# EAGLE design rf-temperature-sensor (EAGLE 9.6.2)
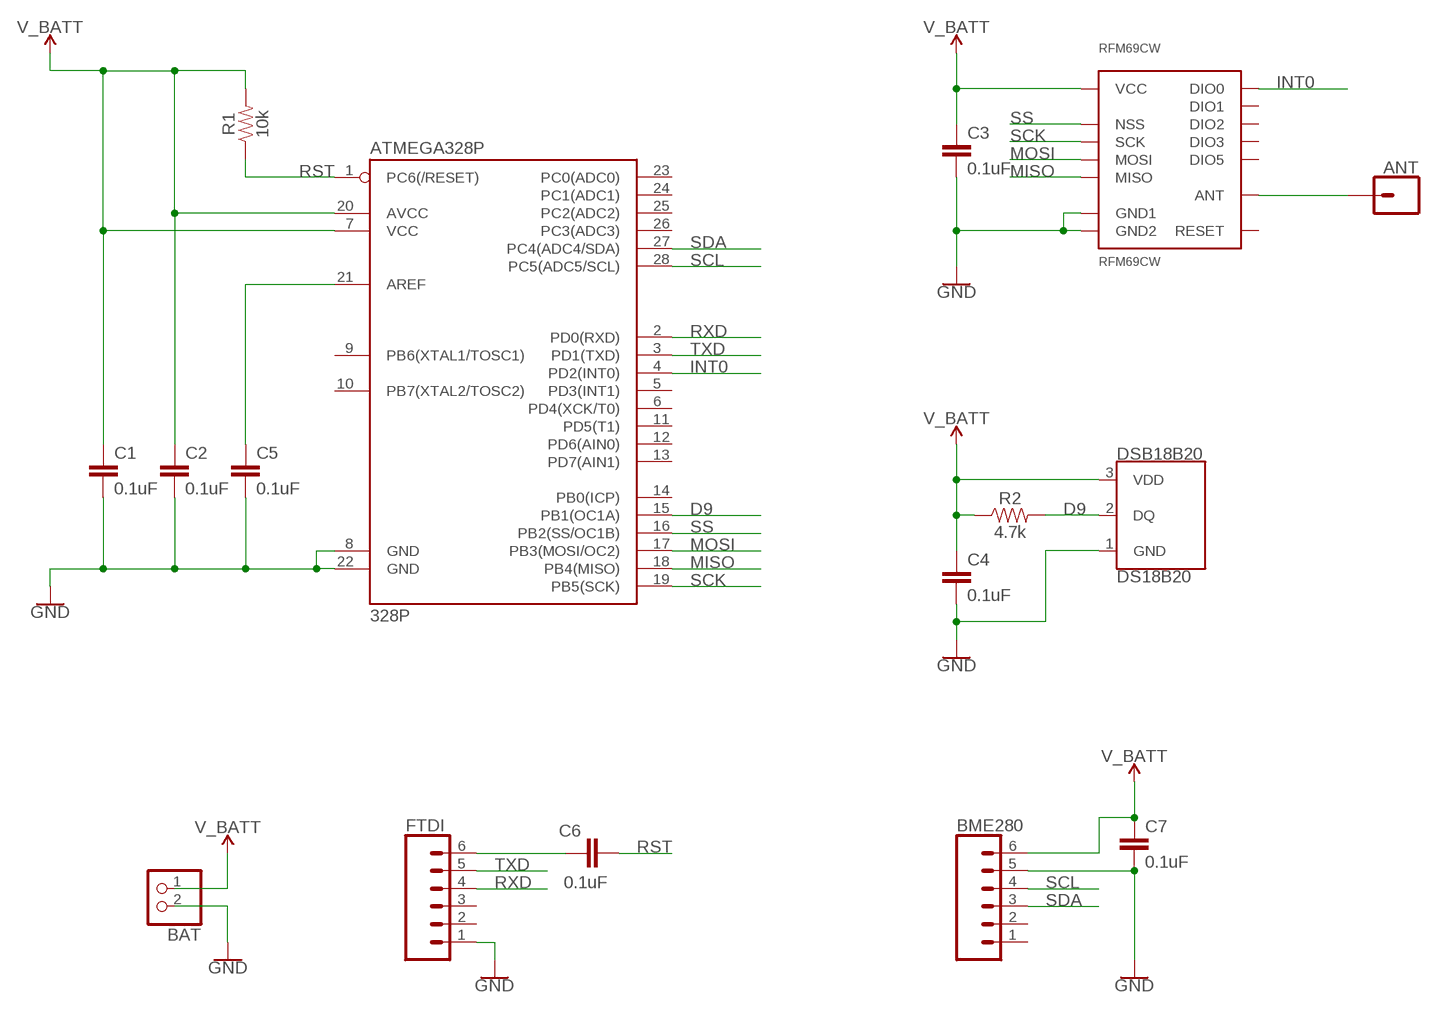
[diagram p0: schematic, sheet 1]

## Parts
ANT  CONN_01  [1X01]
ATMEGA328P  328P  ATMEGA328P_PDIP  [DIP28]
BAT  JST_2PIN-THM-RA  [JST-PH-2-THM-RA]
BME280  CONN_06SILK_FEMALE_PTH  [1X06]
C1  0.1uF  0.1UF-0603-25V-5%  [0603]
C2  0.1uF  0.1UF-0603-25V-5%  [0603]
C3  0.1uF  0.1UF-0603-25V-5%  [0603]
C4  0.1uF  0.1UF-0603-25V-5%  [0603]
C5  0.1uF  0.1UF-0603-25V-5%  [0603]
C6  0.1uF  0.1UF-0603-25V-5%  [0603]
C7  0.1uF  0.1UF-0603-25V-5%  [0603]
DSB18B20  DS18B20  [TO-92-AMMO]
FTDI  CONN_06SILK_FEMALE_PTH  [1X06]
R1  10k  10KOHM-0603-1/10W-1%  [0603]
R2  4.7k  4.7KOHM-0603-1/10W-1%  [0603]
RFM69CW  RFM69CW  [RFM69CW]

## Nets
D9: ATMEGA328P.15(PB1(OC1A)) DSB18B20.2(DQ) R2.2
GND: ATMEGA328P.8(GND) ATMEGA328P.22(GND) BAT.2 BME280.5 C1.2 C2.2 C3.2 C4.2 C5.2 C7.2 DSB18B20.1(GND) FTDI.1 RFM69CW.GND@1(GND1) RFM69CW.GND@2(GND2)
INT0: ATMEGA328P.4(PD2(INT0)) RFM69CW.DIO0
MISO: ATMEGA328P.18(PB4(MISO)) RFM69CW.MISO
MOSI: ATMEGA328P.17(PB3(MOSI/OC2)) RFM69CW.MOSI
N$2: ATMEGA328P.21(AREF) C5.1
N$3: ANT.1 RFM69CW.ANT
N$7: C6.1 FTDI.6
RST: ATMEGA328P.1(PC6(/RESET)) C6.2 R1.1
RXD: ATMEGA328P.2(PD0(RXD)) FTDI.4
SCK: ATMEGA328P.19(PB5(SCK)) RFM69CW.SCK
SCL: ATMEGA328P.28(PC5(ADC5/SCL)) BME280.4
SDA: ATMEGA328P.27(PC4(ADC4/SDA)) BME280.3
SS: ATMEGA328P.16(PB2(SS/OC1B)) RFM69CW.NSS
TXD: ATMEGA328P.3(PD1(TXD)) FTDI.5
V_BATT: ATMEGA328P.7(VCC) ATMEGA328P.20(AVCC) BAT.1 BME280.6 C1.1 C2.1 C3.1 C4.1 C7.1 DSB18B20.3(VDD) R1.2 R2.1 RFM69CW.VDD(VCC)
Unconnected: ATMEGA328P.5(PD3(INT1)) ATMEGA328P.6(PD4(XCK/T0)) ATMEGA328P.9(PB6(XTAL1/TOSC1)) ATMEGA328P.10(PB7(XTAL2/TOSC2)) ATMEGA328P.11(PD5(T1)) ATMEGA328P.12(PD6(AIN0)) ATMEGA328P.13(PD7(AIN1)) ATMEGA328P.14(PB0(ICP)) ATMEGA328P.23(PC0(ADC0)) ATMEGA328P.24(PC1(ADC1)) ATMEGA328P.25(PC2(ADC2)) ATMEGA328P.26(PC3(ADC3)) BME280.1 BME280.2 FTDI.2 FTDI.3 RFM69CW.DIO1 RFM69CW.DIO2 RFM69CW.DIO3 RFM69CW.DIO5 RFM69CW.RESET

## Library data of the parts
ANT = SparkFun-Connectors:CONN_01: Single connection point. Often used as Generic Header-pin footprint for 0.1 inch spaced/style header connections On any of the 0.1 inch spaced packages, you can populate with these: Break Away Headers - Straight <https://www.sparkfun.com/products/116> (PRT-00116) Break Away Male Headers - Right Angle <https://www.sparkfun.com/products/553> (PRT-00553) Female Headers <https://www.sparkfun.com/products/115> (PRT-00115) Break Away Headers - Machine Pin <https://www.sparkfun.com/products/117> (PRT-00117) Break Away Female Headers - Swiss Machine Pin <https://www.sparkfun.com/products/743> (PRT-00743) This device is also useful as a general connection point to wire up your design to another part of your project. Our various solder wires solder well into these plated through hole pads. Hook-Up Wire - Assortment (Stranded, 22 AWG) <https://www.sparkfun.com/products/11375> (PRT-11375) Hook-Up Wire - Assortment (Solid Core, 22 AWG) <https://www.sparkfun.com/products/11367> (PRT-11367) View the entire wire category on our website here <https://www.sparkfun.com/categories/141> Special notes: SMTSO-256-ET is a "flush mount" nut for a 4-40 screw. We mostly use this on specialty testbeds; it is a nice way to connect hardware to your PCB at an adjustable hieght. Also note, the SNAP packages are for using a snappable style connector. We sell a baggie of snaps and they are also used on two LilyPad designs: Snap Assortment - 30 pack (male and female) <https://www.sparkfun.com/products/11347> (DEV-11347) LilyPad Arduino SimpleSnap <https://www.sparkfun.com/products/10941> (DEV-10941) LilyPad SimpleSnap Protoboard <https://www.sparkfun.com/products/10940> (DEV-10940)
ATMEGA328P = SparkFun-IC-Microcontroller:ATMEGA328P_PDIP: Atmel 328P Through hole ATMEGA328P uC used in the Arduino 32kb flash, 1k EEPROM, 2k SRAM Datasheet <http://www.sparkfun.com/datasheets/Components/SMD/ATMega328.pdf> SparkFun Products Storefront component: AVR 28 Pin 20MHz 32K 6A/D - ATMega328P <https://www.sparkfun.com/products/9061> (COM-09061) SparkFun Simon Says - Through-Hole Soldering Kit <https://www.sparkfun.com/products/10547> (KIT-10547) SparkFun Learn to Solder - Simon Says <https://www.sparkfun.com/products/13708> (KIT-13708) SparkFun BigTime Watch Kit <https://www.sparkfun.com/products/11734> (KIT-11734) SparkFun ClockIt <https://www.sparkfun.com/products/10930> (KIT-10930) SparkFun Serial Enabled LCD Kit <https://www.sparkfun.com/products/10097> (LCD-10097) SparkFun Simon Tilts - Through Hole Soldering Kit <https://www.sparkfun.com/products/12634> (KIT-12634) SparkFun Frequency Counter Kit <https://www.sparkfun.com/products/10140> (KIT-10140) FabFM Radio Kit <https://www.sparkfun.com/products/11043> (KIT-11043) SparkFun Binary Blaster Kit <https://www.sparkfun.com/products/12037> (KIT-12037) SparkFun Metro-Gnome <https://www.sparkfun.com/products/9236> (KIT-09236) ATmega328 with Arduino Optiboot (Uno) <https://www.sparkfun.com/products/10524> (DEV-10524); PROD_ID: IC-09136
BAT = adafruit:JST_2PIN: JST 2-Pin Connectors of various flavors SMT-RA (S2B-PH-SM4) 4UConnector #17311 SMT (B2B-PH-SM4) THM-RA (S2B-PH) THM (B2B-PH)
BME280 FTDI = SparkFun-Connectors:CONN_06: Multi connection point. Often used as Generic Header-pin footprint for 0.1 inch spaced/style header connections On any of the 0.1 inch spaced packages, you can populate with these: Break Away Headers - Straight <https://www.sparkfun.com/products/116> (PRT-00116) Break Away Male Headers - Right Angle <https://www.sparkfun.com/products/553> (PRT-00553) Female Headers <https://www.sparkfun.com/products/115> (PRT-00115) Break Away Headers - Machine Pin <https://www.sparkfun.com/products/117> (PRT-00117) Break Away Female Headers - Swiss Machine Pin <https://www.sparkfun.com/products/743> (PRT-00743) Arduino Stackable Header - 6 Pin <https://www.sparkfun.com/products/9280> (PRT-09280) For SCREWTERMINALS and SPRING TERMINALS visit here: Screw Terimnals on SparkFun.com <https://www.sparkfun.com/search/results?term=Screw+Terminals> (5mm/3.5mm/2.54mm spacing) This device is also useful as a general connection point to wire up your design to another part of your project. Our various solder wires solder well into these plated through hole pads. Hook-Up Wire - Assortment (Stranded, 22 AWG) <https://www.sparkfun.com/products/11375> (PRT-11375) Hook-Up Wire - Assortment (Solid Core, 22 AWG) <https://www.sparkfun.com/products/11367> (PRT-11367) View the entire wire category on our website here <https://www.sparkfun.com/categories/141>; PROD_ID: CONN-08437
C1-C7 = SparkFun-Capacitors:0.1UF: 0.1µF ceramic capacitors A capacitor is a passive two-terminal electrical component used to store electrical energy temporarily in an electric field.; PROD_ID: CAP-08604
DSB18B20 = SparkFun-Sensors:DS18B20: Dallas/Maxim DS18B20 1-Wire Temperature Sensor The DS18B20 reports degrees C with 9 to 12-bit precision, -55C to 125C (+/-0.5C). Each sensor has a unique 64-Bit Serial number etched into it - allows for a huge number of sensors to be used on one data bus. Datasheet <http://datasheets.maximintegrated.com/en/ds/DS18B20.pdf> SparkFun Products One Wire Digital Temperature Sensor - DS18B20 <https://www.sparkfun.com/products/245> (SEN-00245); STORE_ID: SEN-00245
R1 = SparkFun-Resistors:10KOHM: 10kΩ resistor A resistor is a passive two-terminal electrical component that implements electrical resistance as a circuit element. Resistors act to reduce current flow, and, at the same time, act to lower voltage levels within circuits. - Wikipedia; PROD_ID: RES-00824
R2 = SparkFun-Resistors:4.7KOHM: 4.7kΩ resistor A resistor is a passive two-terminal electrical component that implements electrical resistance as a circuit element. Resistors act to reduce current flow, and, at the same time, act to lower voltage levels within circuits. - Wikipedia; PROD_ID: RES-07857
RFM69CW = kanflo:RFM69CW: HopeRFs RFM69CW with all digital IOs available.

## Board
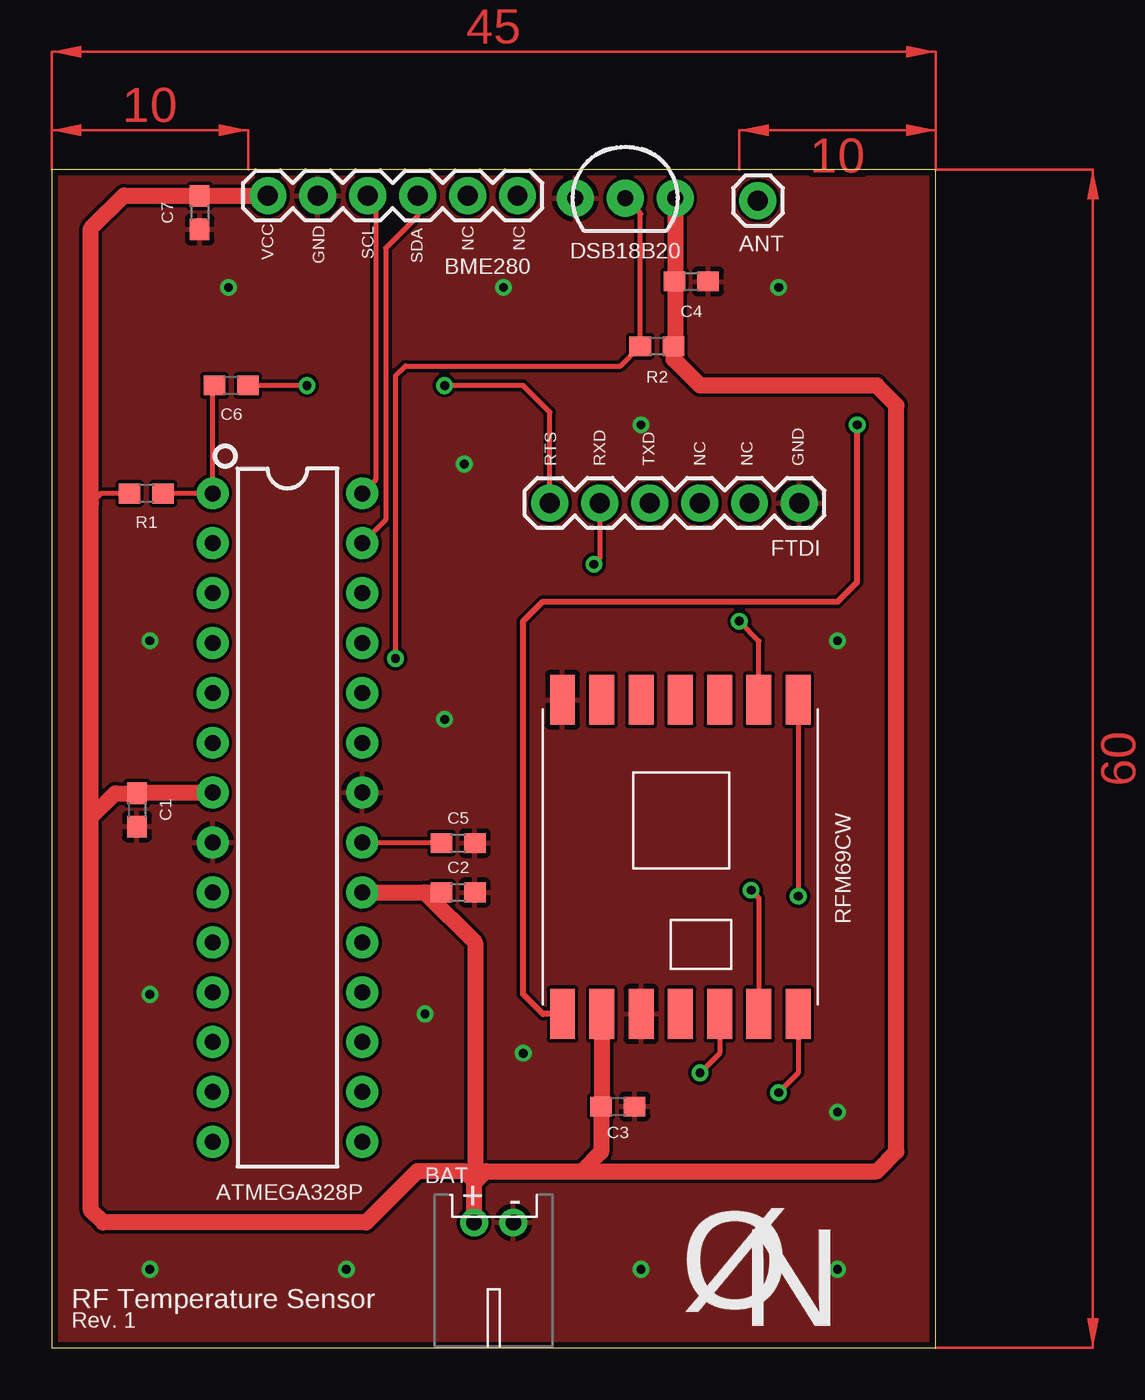
[diagram p1: board, top side]
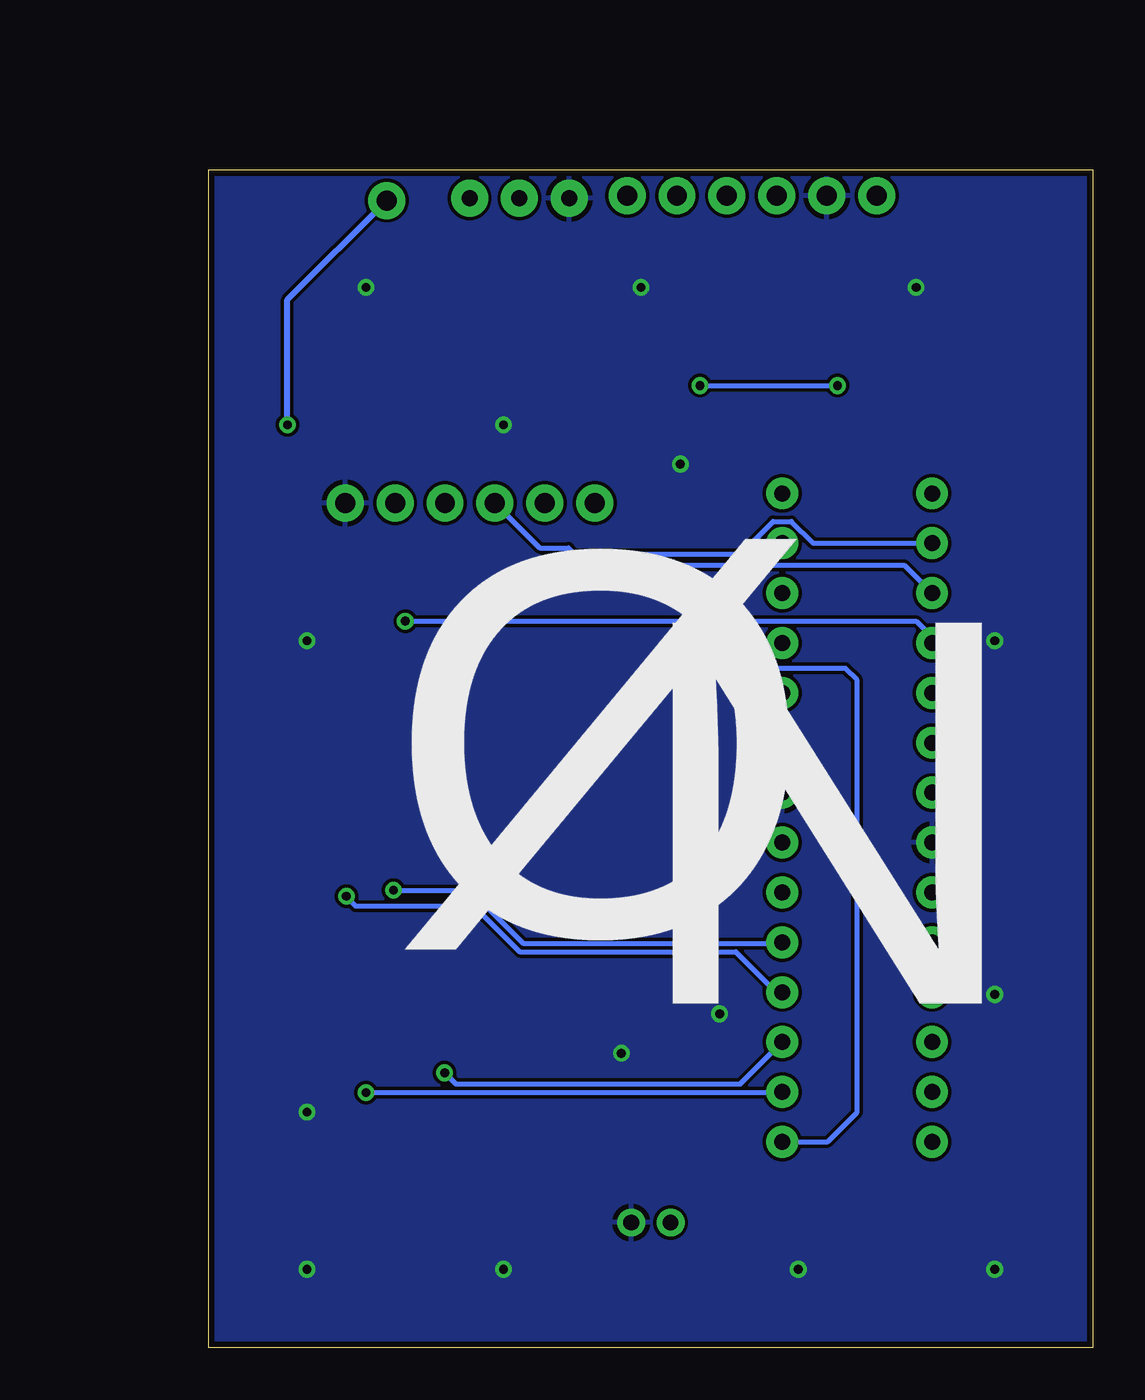
[diagram p2: board, bottom side, seen from below]

Size 45 x 60 mm. Coordinates in mm from the lower left corner, seen from the top.
Outline: 0,0 45,0 45,60 0,60 0,0
Copper layers (1*16): Top 0.035mm / dielectric 1.5mm / Bottom 0.035mm
Design rules "aisler_2_layer_simple": minimum track width 0.2mm, minimum drill 0.45mm, track to track 0.175mm, track to pad 0.175mm, pad to pad 0.175mm, via to via 0.175mm, smd to smd 0.175mm, copper to edge 0.3mm, drill to drill 0.25mm, minimum pad ring 0.2mm, minimum via ring 0.2mm, stop-mask expansion 0mil, vias tented up to drill 0mil, thermal gap 10mil

### Footprints (pad centres in the part's own frame; a part is rotated, then mirrored left to right if it is on the bottom)
1X01 = drill 1.016 pad 1.88: 1 0,0
DIP28 = drill 0.813 pad 1.626: 1 -16.51,-3.81; 2 -13.97,-3.81; 3 -11.43,-3.81; 4 -8.89,-3.81; 5 -6.35,-3.81; 6 -3.81,-3.81; 7 -1.27,-3.81; 8 1.27,-3.81; 9 3.81,-3.81; 10 6.35,-3.81; 11 8.89,-3.81; 12 11.43,-3.81; 13 13.97,-3.81; 14 16.51,-3.81; 15 16.51,3.81; 16 13.97,3.81; 17 11.43,3.81; 18 8.89,3.81; 19 6.35,3.81; 20 3.81,3.81; 21 1.27,3.81; 22 -1.27,3.81; 23 -3.81,3.81; 24 -6.35,3.81; 25 -8.89,3.81; 26 -11.43,3.81; 27 -13.97,3.81; 28 -16.51,3.81
JST-PH-2-THM-RA = drill 0.8 pad 1.422: 1 1,0; 2 -1,0
1X06 = drill 1.016 pad 1.88: 1 0,0; 2 2.54,0; 3 5.08,0; 4 7.62,0; 5 10.16,0; 6 12.7,0
0603 = smd 1.1 x 1: 1 -0.85,0; 2 0.85,0
TO-92-AMMO = drill 0.813 pad 1.88: 1 -2.54,0; 2 0,0; 3 2.54,0
RFM69CW = smd 2.54 x 1.27: ANT 8,-6; DIO0 -8,4; DIO1 -8,0; DIO2 -8,2; DIO3 8,0; DIO5 -8,-2; GND@1 8,-2; GND@2 -8,-6; MISO -8,6; MOSI 8,2; NSS 8,6; RESET -8,-4; SCK 8,4; VDD 8,-4

### Placement (x,y rotation side)
ANT  35.95,58.42 0 top
ATMEGA328P  12,27 270 top
BAT  22.5,6.38 180 top
BME280  23.71,58.67 180 top
C1  4.34,27.39 270 top
C2  20.69,23.19 0 top
C3  28.82,12.29 0 top
C4  32.56,54.3 0 top
C5  20.69,25.7 0 top
C6  9.14,49 180 top
C7  7.53,57.8 270 top
DSB18B20  29.19,58.54 0 top
FTDI  38.06,43.02 180 top
R1  4.82,43.5 180 top
R2  30.81,51 180 top
RFM69CW  32,25 270 top

### Tracks (layer width: path | path; a pad name or v marks a point on that pad's centre or on a via)
D9  (via drill 0.45)
  Top 0.254: DSB18B20.2 29.99,57.74 29.96,57.71 R2.2 28.96,50 18,50 17.5,49.5 v17.5,35.1
  Bottom 0.254: ATMEGA328P.15 13.51,10.49 12,12 12,34 12.6,34.6 17.3,34.6 17.5,34.8 v17.5,35.1
GND  (via drill 0.45)
  other vias: 5,4 15,4 30,4 40,4 9,54 23,54 5,36 5,18 30,47 21,45 20,32 19,17 40,12 40,36 24,15 37,54
  pour Top: 0,60 45,60 45,0 0,0
  pour Bottom: 0,60 45,60 45,0 0,0
INT0  (via drill 0.45)
  Top 0.254: v35,37 36,36 RFM69CW.DIO0
  Bottom 0.254: v35,37 16.28,37 16.27,37.01 15.35,37.01 15.34,37 9,37 8.19,36.19 ATMEGA328P.4
MISO  (via drill 0.45)
  Top 0.254: RFM69CW.MISO v38,23
  Bottom 0.254: v38,23 38,22.97 37.53,22.5 31.51,22.5 29.18,20.17 18.17,20.17 16.11,18.11 ATMEGA328P.18
MOSI  (via drill 0.45)
  Top 0.254: RFM69CW.MOSI 34,15 v33,14
  Bottom 0.254: v33,14 32.43,13.43 17.95,13.43 ATMEGA328P.17
N$2
  Top 0.254: ATMEGA328P.21 19.81,25.73 C5.1
N$3  (via drill 0.45)
  Top 0.305: RFM69CW.ANT 25,17 24,18 24,37 25,38 40,38 41,39 v41,47
  Bottom 0.305: ANT.1 41,53.37 v41,47
N$7  (via drill 0.45)
  Top 0.254: FTDI.6 25.36,47.64 24,49 v20,49 | v13,49 C6.1
  Bottom 0.254: v20,49 v13,49
RST
  Top 0.254: R1.1 ATMEGA328P.1 8.19,48.9 C6.2
RXD
  Bottom 0.254: FTDI.4 28.15,40.73 26.7,40.73 26.4,40.43 17.93,40.43 16.27,42.09 15.35,42.09 14.23,40.97 ATMEGA328P.2
SCK  (via drill 0.45)
  Top 0.254: v35.6,23.3 36,22.9 RFM69CW.SCK
  Bottom 0.254: v35.6,23.3 31.7,23.3 29,20.6 15.86,20.6 ATMEGA328P.19
SCL
  Top 0.254: BME280.4 16.49,58.27 16.49,44.19 ATMEGA328P.28
SDA
  Top 0.254: BME280.3 18.63,57.63 17,56 17,42.16 ATMEGA328P.27
SS  (via drill 0.45)
  Top 0.254: RFM69CW.NSS 38,14 v37,13
  Bottom 0.254: v37,13 15.84,13 ATMEGA328P.16
TXD  (via drill 0.45)
  Top 0.254: FTDI.5 27.9,40.2 v27.6,39.9
  Bottom 0.254: ATMEGA328P.3 9.62,39.85 27.55,39.85 v27.6,39.9
V_BATT
  Top 0.254: R1.2 2.5,43.5 2,43
  Top 0.813: 2,27 2,7 2.62,6.38 16,6.38 18.62,9 21,9 21.5,8.5 | 2,27 2,43 2,57 3.67,58.67 7.51,58.67 C7.1 7.55,58.67 BME280.6 | 2,27 3.24,28.24 C1.1 4.37,28.27 ATMEGA328P.7 | BAT.1 21.5,8.5 | 21.55,8.45 21.5,8.5 | 21.55,8.45 22.1,9 27,9 | 27,9 42,9 43,10 43,48 42,49 33,49 31.66,50.34 R2.1 31.73,51.07 31.73,54.28 C4.1 31.73,54.32 DSB18B20.3 | ATMEGA328P.20 19,23.19 | 19,23.19 C2.1 | 19,23.19 21.55,20.64 21.55,8.45 | RFM69CW.VDD 28,12.32 C3.1 27.97,9.97 27,9
(copper drawn outside any net)
  shapes: Top area x4

### Text on the board
tNames: NC | NC | VCC | GND | SCL | SDA | RTS | RXD | TXD | NC | NC | GND | RF Temperature Sensor | Ø | Rev. 1 | N
bNames: Ø | N